# Altium project Ramp-generator.PrjPcb
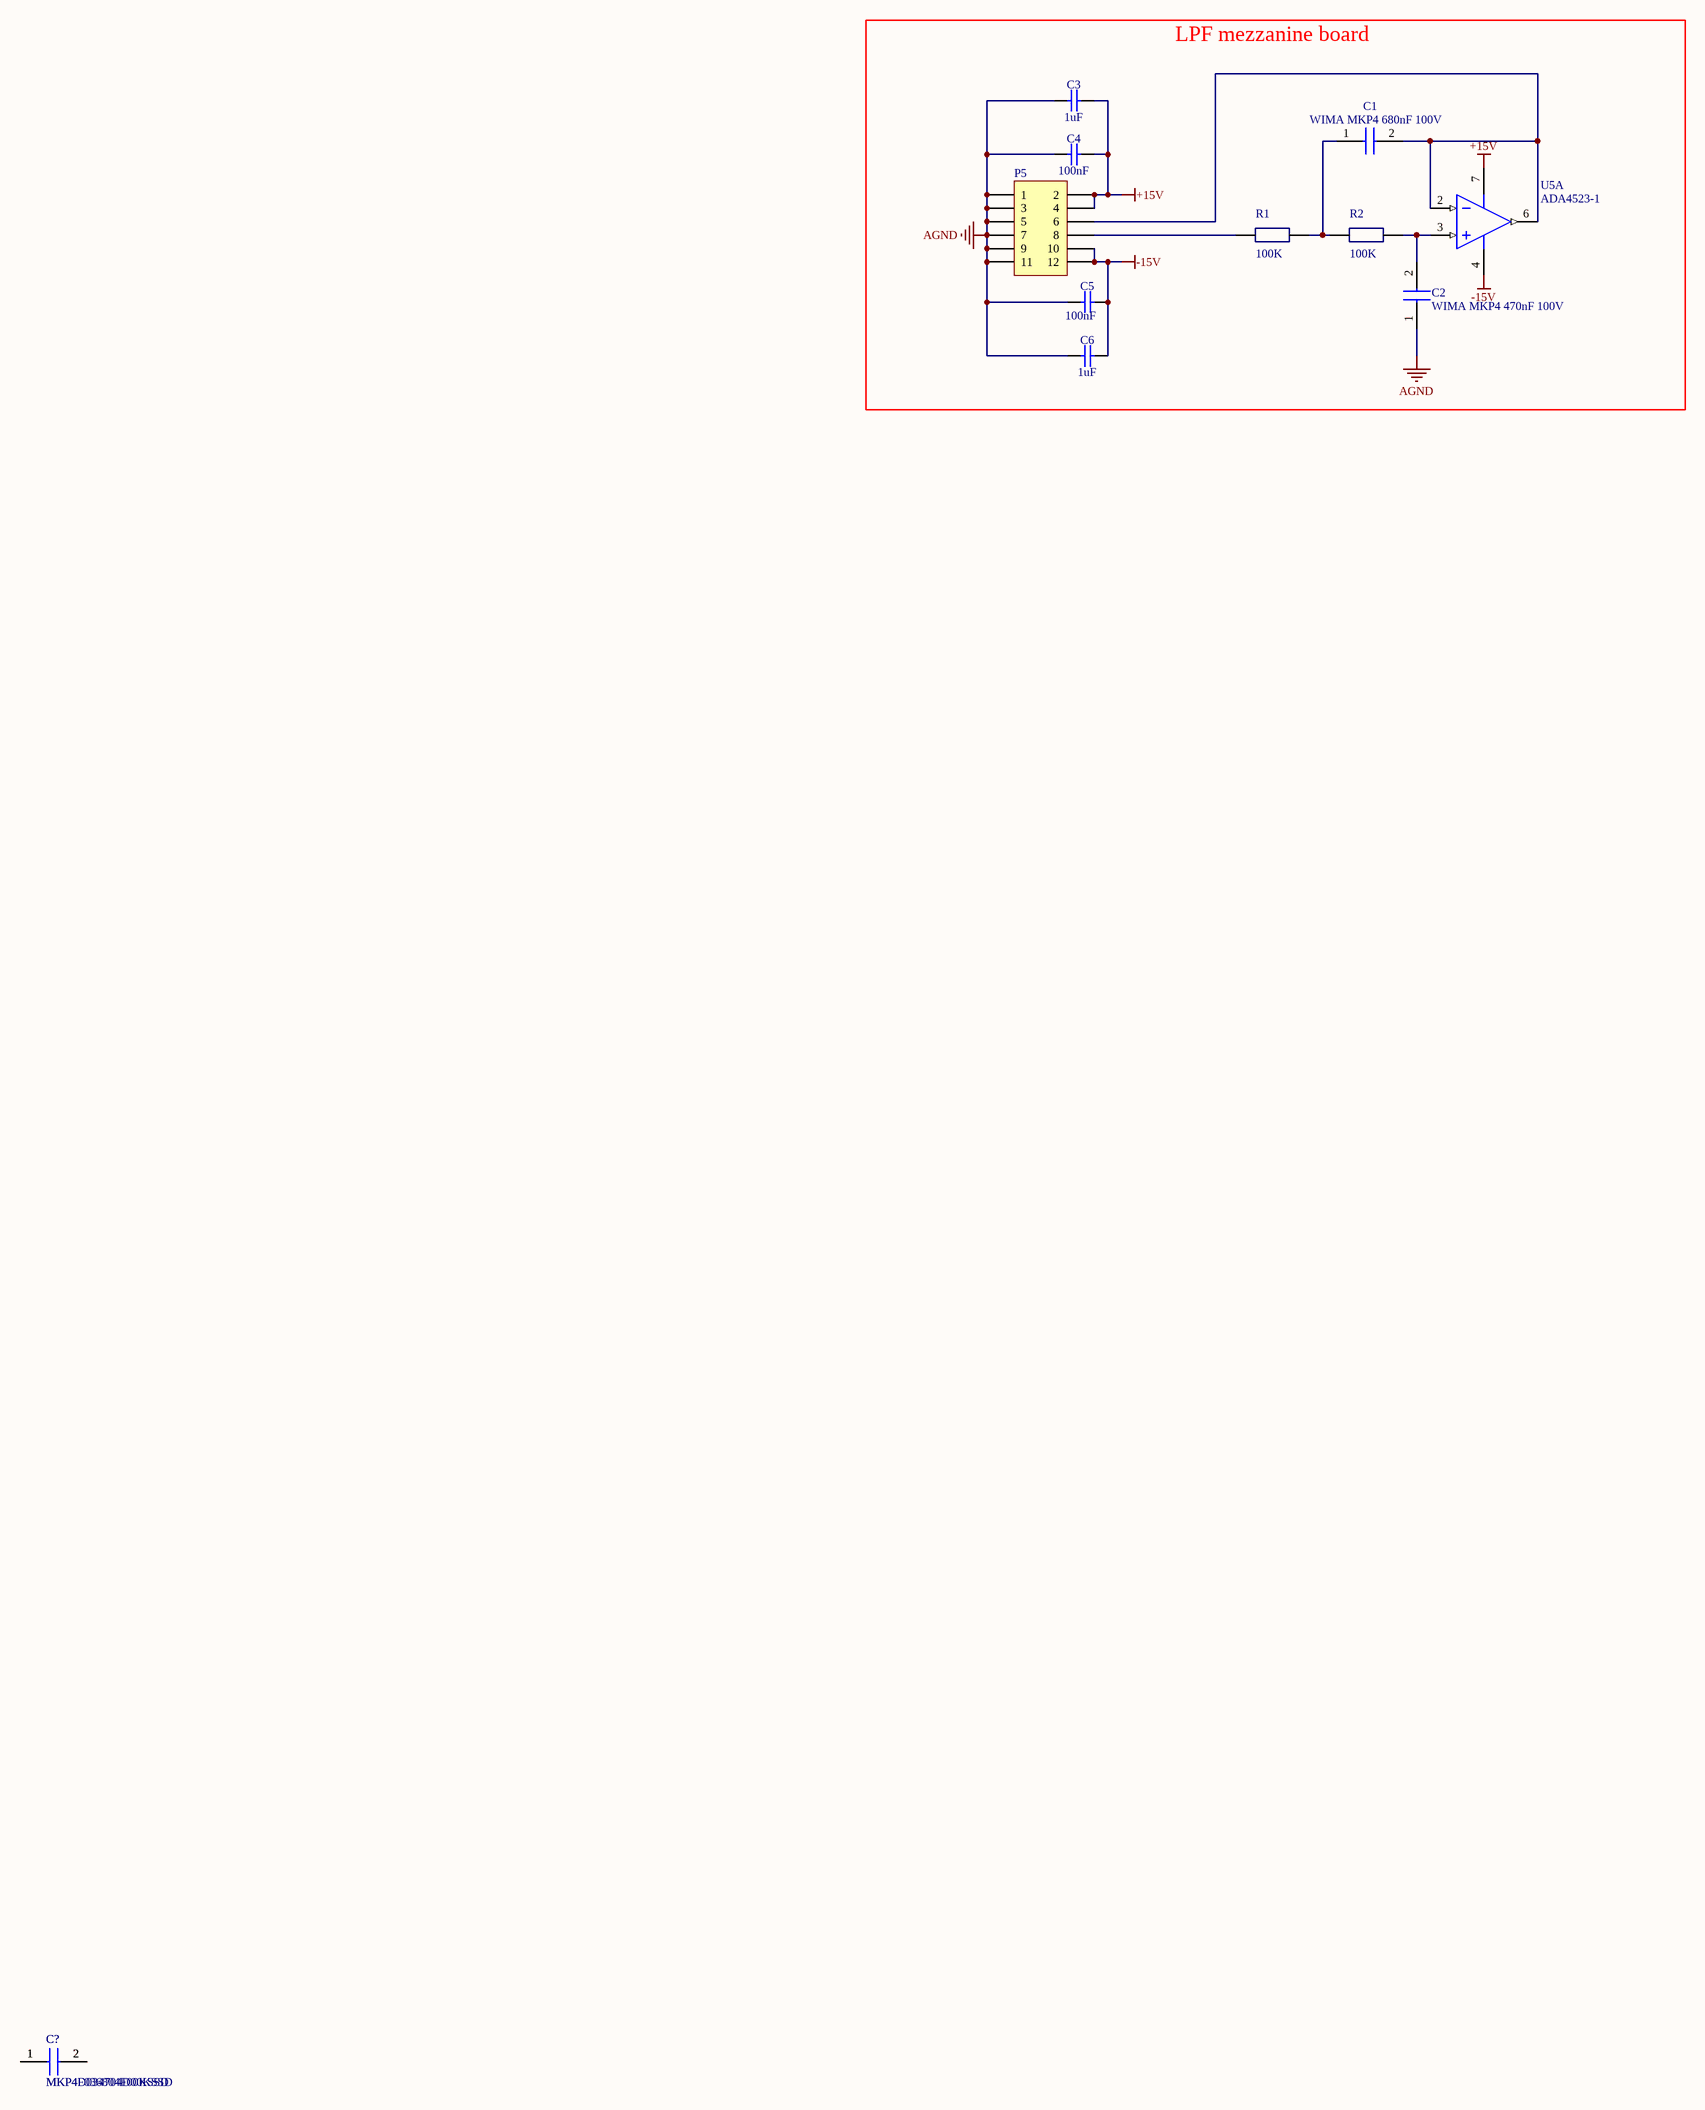
[diagram p0: shcematics.SchDoc]
1 sheet, 12 parts. Net scope: global (net labels, ports and power ports of the same name join across sheets).
Board file: PCB1.PcbDoc

## Sheet shcematics.SchDoc: Ultra-Precision low speed ramp generator for low current calibration
size A2; PageSetup: Record=PageOptions|CenterHorizontal=True|CenterVertical=True|PrintScale=0.52|XCorrection=1.00|YCorrection=1.00|PrintKind=0|BorderSize=5000000|LeftOffset=0|BottomOffset=0|Orientation=2|PaperLength=1000|PaperWidth=1000|Scale=100|PaperSource=7|PrintQuality=-3|MediaType=1|DitherType=10|PrintScaleMode=1|PaperKind=A4|PaperIndex=9

### Parts
(Parts that share a designator on the sheet are numbered #1, #2 ... from top to bottom, then left to right.)
C1  WIMA MKP4 680nF 100V  [MKP4F036804F00KSSD]
C2  WIMA MKP4 470nF 100V  [MKP4D034704D00KSSD]
C3  1uF  [CAPC1608X87N]
C4  100nF  [CAPC1608X87N]
C5  100nF  [CAPC1608X87N]
C6  1uF  [CAPC1608X87N]
C?#1  MKP4D034704D00KSSD  [MKP4D034704D00KSSD]
C?#2  MKP4F036804F00KSSD  [MKP4F036804F00KSSD]
P5  LPF mezzanine board  [HDR2X6]  (value not drawn)
R1  100K  [Yegeo 0603]
R2  100K  [Yegeo 0603]
U5  ADA4523-1  [TI-D8_N]  (part A of 2)

### Blocks framed on the sheet
LPF mezzanine board: C1-C6 P5 R1 R2 U5

### Nets
+15V: C3.2 C4.2 P5.2 P5.4 U5.7(V+)
-15V: C5.2 C6.2 P5.10 P5.12 U5.4(V-)
AGND: C2.1 C3.1 C4.1 C5.1 C6.1 P5.1 P5.3 P5.5 P5.7 P5.9 P5.11
NetC1_1: C1.1 R1.1(A) R2.2
NetC1_2: C1.2 P5.6 U5.2(IN-) U5.6(OUT)
NetC2_2: C2.2 R2.1(A) U5.3(IN+)
NetC?#1_1: C?#1.1 C?#2.1
NetC?#1_2: C?#1.2 C?#2.2
NetP5_8: P5.8 R1.2

### Library data of the parts
C1 = MKP4F036804F00KSSD: Capacitor; Datasheet Link: https://componentsearchengine.com/Datasheets/1/MKP4F036804F00KSSD.pdf; Height: 15mm; Manufacturer_Name: WIMA; Manufacturer_Part_Number: MKP4F036804F00KSSD; Mouser Part Number: 505-MKP4F036804F00KS; Mouser Price/Stock: https://www.mouser.co.uk/ProductDetail/WIMA/MKP4F036804F00KSSD?qs=7N384g6sXM%2Ff4ZVcxZrvpg%3D%3D; Arrow Part Number: MKP4F036804F00KSSD; Arrow Price/Stock: https://www.arrow.com/en/products/mkp4f036804f00kssd/wima
C2 = MKP4D034704D00KSSD: Capacitor; Datasheet Link: https://www.mouser.com/datasheet/2/440/e_WIMA_MKP_4-1139861.pdf; Height: 14mm; Manufacturer_Name: WIMA; Manufacturer_Part_Number: MKP4D034704D00KSSD; Mouser Part Number: 505-MKP4D034704D00KS; Mouser Price/Stock: https://www.mouser.co.uk/ProductDetail/WIMA/MKP4D034704D00KSSD?qs=OanN%252B0kfw%2FZgVh%2F%2FnXAWCg%3D%3D
C3 C6 = CC0603_1UF_50V_10%_X5R: Non-polarised capacitor; Part Description: SMD Multilayer Chip Ceramic Capacitor; Manufacturer: GENERIC; Manufacturer1 Part Number: C1608X5R1H105K080; Voltage: 50V; TC: X5R; Tolerance: ±10%; Part Number: CC0603_1UF_50V_10%_X5R; Component Kind: Standard; Component Type: Standard; Pin Count: 2; Value: 1uF; Status: None; Manufacturer Part Number: CC0603_1UF_50V_10%_X5R; Case: 0603; Mounted: Yes; Socket: No; SMD: Yes; Sense: No; Manufacturer1 Example: TDK; Manufacturer1 ComponentHeight: 0.9mm; HelpURL: \\cern.ch\dfs\Applications\Altium\Datasheets\CC0603_X5R_TDK_C.pdf; Author: CERN DEM JMW; CreateDate: 09.11.2015; LatestRevisionDate: 09.11.2015
C4 C5 = CC0603_100NF_50V_10%_X5R: Non-polarised capacitor; Part Description: SMD Multilayer Chip Ceramic Capacitor; Manufacturer: GENERIC; Manufacturer1 Part Number: C1608X5R1H104K080AA; Voltage: 50V; TC: X5R; Tolerance: ±10%; Part Number: CC0603_100NF_50V_10%_X5R; Component Kind: Standard; Component Type: Standard; Pin Count: 2; Value: 100nF; Status: None; Manufacturer Part Number: CC0603_100NF_50V_10%_X5R; Case: 0603; Mounted: Yes; Socket: No; SMD: Yes; Sense: No; Manufacturer1 Example: TDK; Manufacturer1 ComponentHeight: 0.9mm; HelpURL: \\cern.ch\dfs\Applications\Altium\Datasheets\CC0603_X5R_TDK_C.pdf; Author: CERN DEM MR; CreateDate: 08.01.2016; LatestRevisionDate: 08.01.2016
C?#1 = MKP4D034704D00KSSD: Capacitor; Manufacturer_Name: WIMA; Datasheet Link: https://www.mouser.com/datasheet/2/440/e_WIMA_MKP_4-1139861.pdf; Height: 14mm; Manufacturer_Part_Number: MKP4D034704D00KSSD; Mouser Part Number: 505-MKP4D034704D00KS; Mouser Price/Stock: https://www.mouser.co.uk/ProductDetail/WIMA/MKP4D034704D00KSSD?qs=OanN%252B0kfw%2FZgVh%2F%2FnXAWCg%3D%3D
C?#2 = MKP4F036804F00KSSD: Capacitor; Manufacturer_Name: WIMA; Datasheet Link: https://componentsearchengine.com/Datasheets/1/MKP4F036804F00KSSD.pdf; Height: 15mm; Manufacturer_Part_Number: MKP4F036804F00KSSD; Mouser Part Number: 505-MKP4F036804F00KS; Mouser Price/Stock: https://www.mouser.co.uk/ProductDetail/WIMA/MKP4F036804F00KSSD?qs=7N384g6sXM%2Ff4ZVcxZrvpg%3D%3D; Arrow Part Number: MKP4F036804F00KSSD; Arrow Price/Stock: https://www.arrow.com/en/products/mkp4f036804f00kssd/wima
P5 = Header 6X2: Header, 6-Pin, Dual row; LatestRevisionDate: 17-Jul-2002; LatestRevisionNote: Re-released for DXP Platform.; Publisher: Altium Limited
R1 R2 = Resistor 0805: Order: ERA-3AEB49R9V; Avail: 20; Value: 100K
U5 = OPA140AIDR: 11 MHz, Single Supply, Low Noise, Precision, Rail-to-Rail Output, JFET Amplifier, 4.5 to 36 V, -40 to 125 degC, 8-pin SOIC (D8), Green (RoHS & no Sb/Br); Manufacturer: Texas Instruments; CMRR(Min)(dB): 126; GBW(Typ)(MHz): 11; IIB(Max)(pA): 10; Iq per channel(Max)(mA): 2; Number of Channels: 1; Offset Drift(Typ)(uV/C): 0.35; Packing: LARGE T&R; Rating: Catalog; Slew Rate(Typ)(V/us): 20; Sub Family: High Supply Voltage Amplifier (>=30V), Low Input Bias Current Amp (<=10pA), Low Noise Amp (<=10nV/rtHz), Low Offset Voltage Amplifier (<=500uV), Precision Amplifier; Total Supply Voltage(Max)(+5V is 5, +/-5V is 10): 36; Total Supply Voltage(Min)(+5V is 5, +/-5V is 10): 4.5; Vio (25C)(Max)(mV): 0.12; DatasheetVersion: SBOS498A; PackageVersion: 4040047-3/M, 06/2011; PackageReference: D8; PackageDescription: 8-Pin Plastic Small Outline, Body 4.9 x 3.9 mm, Pitch 1.27 mm; Supplier 1: Digi-Key; Supplier Part Number 1: OPA140AIDR-ND; Supplier 2: Newark; Supplier Part Number 2: 21T3836; Supplier 3: Mouser; Supplier Part Number 3: 595-OPA140AIDR; Eco-Plan: Green (RoHS & no Sb/Br); Mounting Technology: Surface Mount; Code_JEDEC: MS-012; PartNumber: OPA140AIDR; ComponentLink1Description: Manufacturer URL; ComponentLink1URL: http://www.ti.com/; ComponentLink2Description: Datasheet; ComponentLink2URL: http://www.ti.com/lit/ds/symlink/opa140.pdf; ComponentLink3Description: Package Specification; ComponentLink3URL: http://www.ti.com/litv/pdf/msoi002j